# Altium schematic sheet [02] - CONNECTORS.SchDoc
size Letter
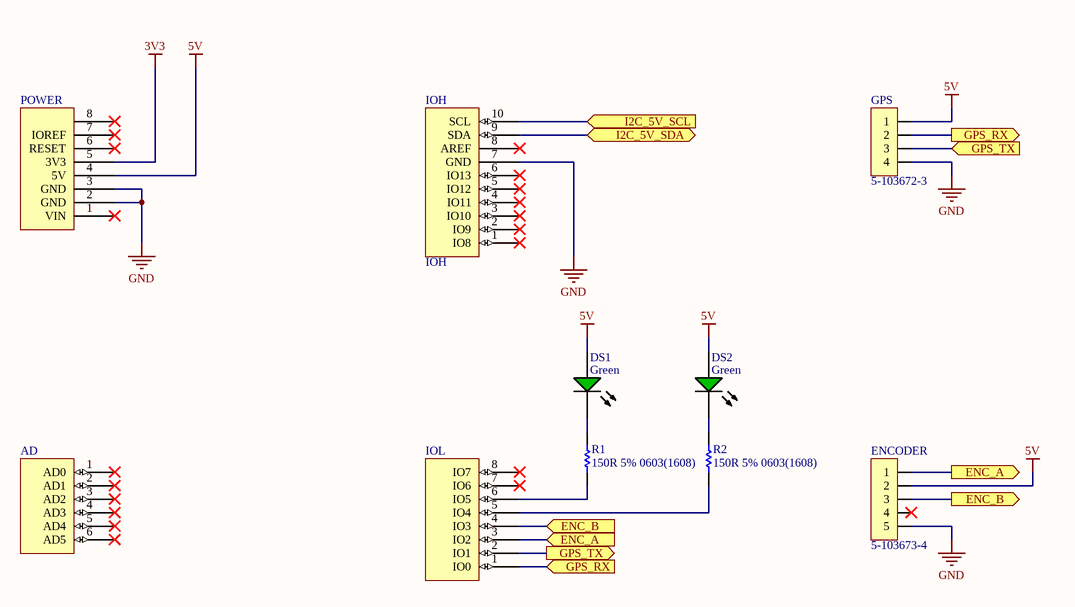
[diagram p0: [02] - CONNECTORS.SchDoc]

## Parts
AD  AD  [Header 6x1 8.5mm]  (value not drawn)
DS1  Color: Green  [KING-LED0603-25-GREEN_V]  (hidden comment: APG1608CGKC/T)
DS2  Color: Green  [KING-LED0603-25-GREEN_V]  (hidden comment: APG1608CGKC/T)
ENCODER  5-103673-4  [Header_5-103673-4_TE]
GPS  5-103672-3  [PCBComponent_1]
IOH  IOH  [Header 10x1 8.5mm]
IOL  IOL  [Header 8x1 8.5mm]  (value not drawn)
POWER  POWER_UNO  [Header 8x1 8.5mm]  (value not drawn)
R1  150R 5% 0603(1608)  [RESC0603(1608)_L]
R2  150R 5% 0603(1608)  [RESC0603(1608)_L]

## Ports
ENC_A (in), ENC_A (out), ENC_B (in), ENC_B (out), GPS_RX (in), GPS_RX (out), GPS_TX (in), GPS_TX (out), I2C_5V_SCL (in), I2C_5V_SDA (bidir)

## Nets
3V3: POWER.5(3V3)
5V: DS1.1(A) DS2.1(A) ENCODER.2 GPS.1 POWER.4(5V)
GND: ENCODER.5 GPS.4 IOH.7(GND) POWER.2(GND) POWER.3(GND)
ENC_A: ENCODER.1 IOL.3(IO2) ; port ENC_A
ENC_B: ENCODER.3 IOL.4(IO3) ; port ENC_B
GPS_RX: GPS.2 IOL.1(IO0) ; port GPS_RX
GPS_TX: GPS.3 IOL.2(IO1) ; port GPS_TX
I2C_5V_SCL: IOH.10(SCL) ; port I2C_5V_SCL
I2C_5V_SDA: IOH.9(SDA) ; port I2C_5V_SDA
NetDS1_2: DS1.2(K) R1.1
NetDS2_2: DS2.2(K) R2.1
NetIOL_5: IOL.5(IO4) R2.2
NetIOL_6: IOL.6(IO5) R1.2

Not connected (* = marked no-connect by the designer): AD 1(AD0)* 2(AD1)* 3(AD2)* 4(AD3)* 5(AD4)* 6(AD5)*; ENCODER 4*; IOH 1(IO8)* 2(IO9)* 3(IO10)* 4(IO11)* 5(IO12)* 6(IO13)* 8(AREF)*; IOL 7(IO6)* 8(IO7)*; POWER 1(VIN)* 6(RESET)* 7(IOREF)* 8*

## Library data of the parts
DS1 DS2 = CMP-0239-00001-1: LED, SMT, 0603(1608), 0.25mm Thickness, Green; Manufacturer Part Number: APT1608MGC; Forward Current: 30 mA; Reverse Voltage: 5 V; Power Dissipation: 78 mW; Packing: Reel; ComponentLink1Description: Manufacturer URL; ComponentLink1URL: http://www.kingbrightusa.com/; ComponentLink2URL: http://www.kingbrightusa.com/images/catalog/SPEC/APG1608CGKC-T.pdf; Mounting Technology: Surface Mount; Storage Temperature: -40 to 85 degC; DatasheetVersion: Rev. 5B, 10/2012; PartNumber: APG1608CGKC/T; PackageReference: LED0603-25-GREEN; ComponentLink2Description: Datasheet; PackageDescription: 2-Pin SMT LED, 1.6 x 0.8 mm Body, 0.25mm Thickness; PackageVersion: Rev. 5B, 10/2012; Digi-key Part Number: 754-1118-1-ND
ENCODER = Header_5-103673-4_TE
GPS = Header_5-103672-3_TE
R1 R2 = CMP-1012-00054-1: 150R 0.1W 5% 0603 (1608 Metric)  SMD; Case-EIA: 0603; Value: 150.00 Ohm; Case-Metric: 1608; Tolerance: 5 %; Technology: SMT; Power: 0.1 W; Digi-Key Part Number: 311-150GRCT-ND